# EAGLE design XBee_Explorer Thin (EAGLE 9.6.2)
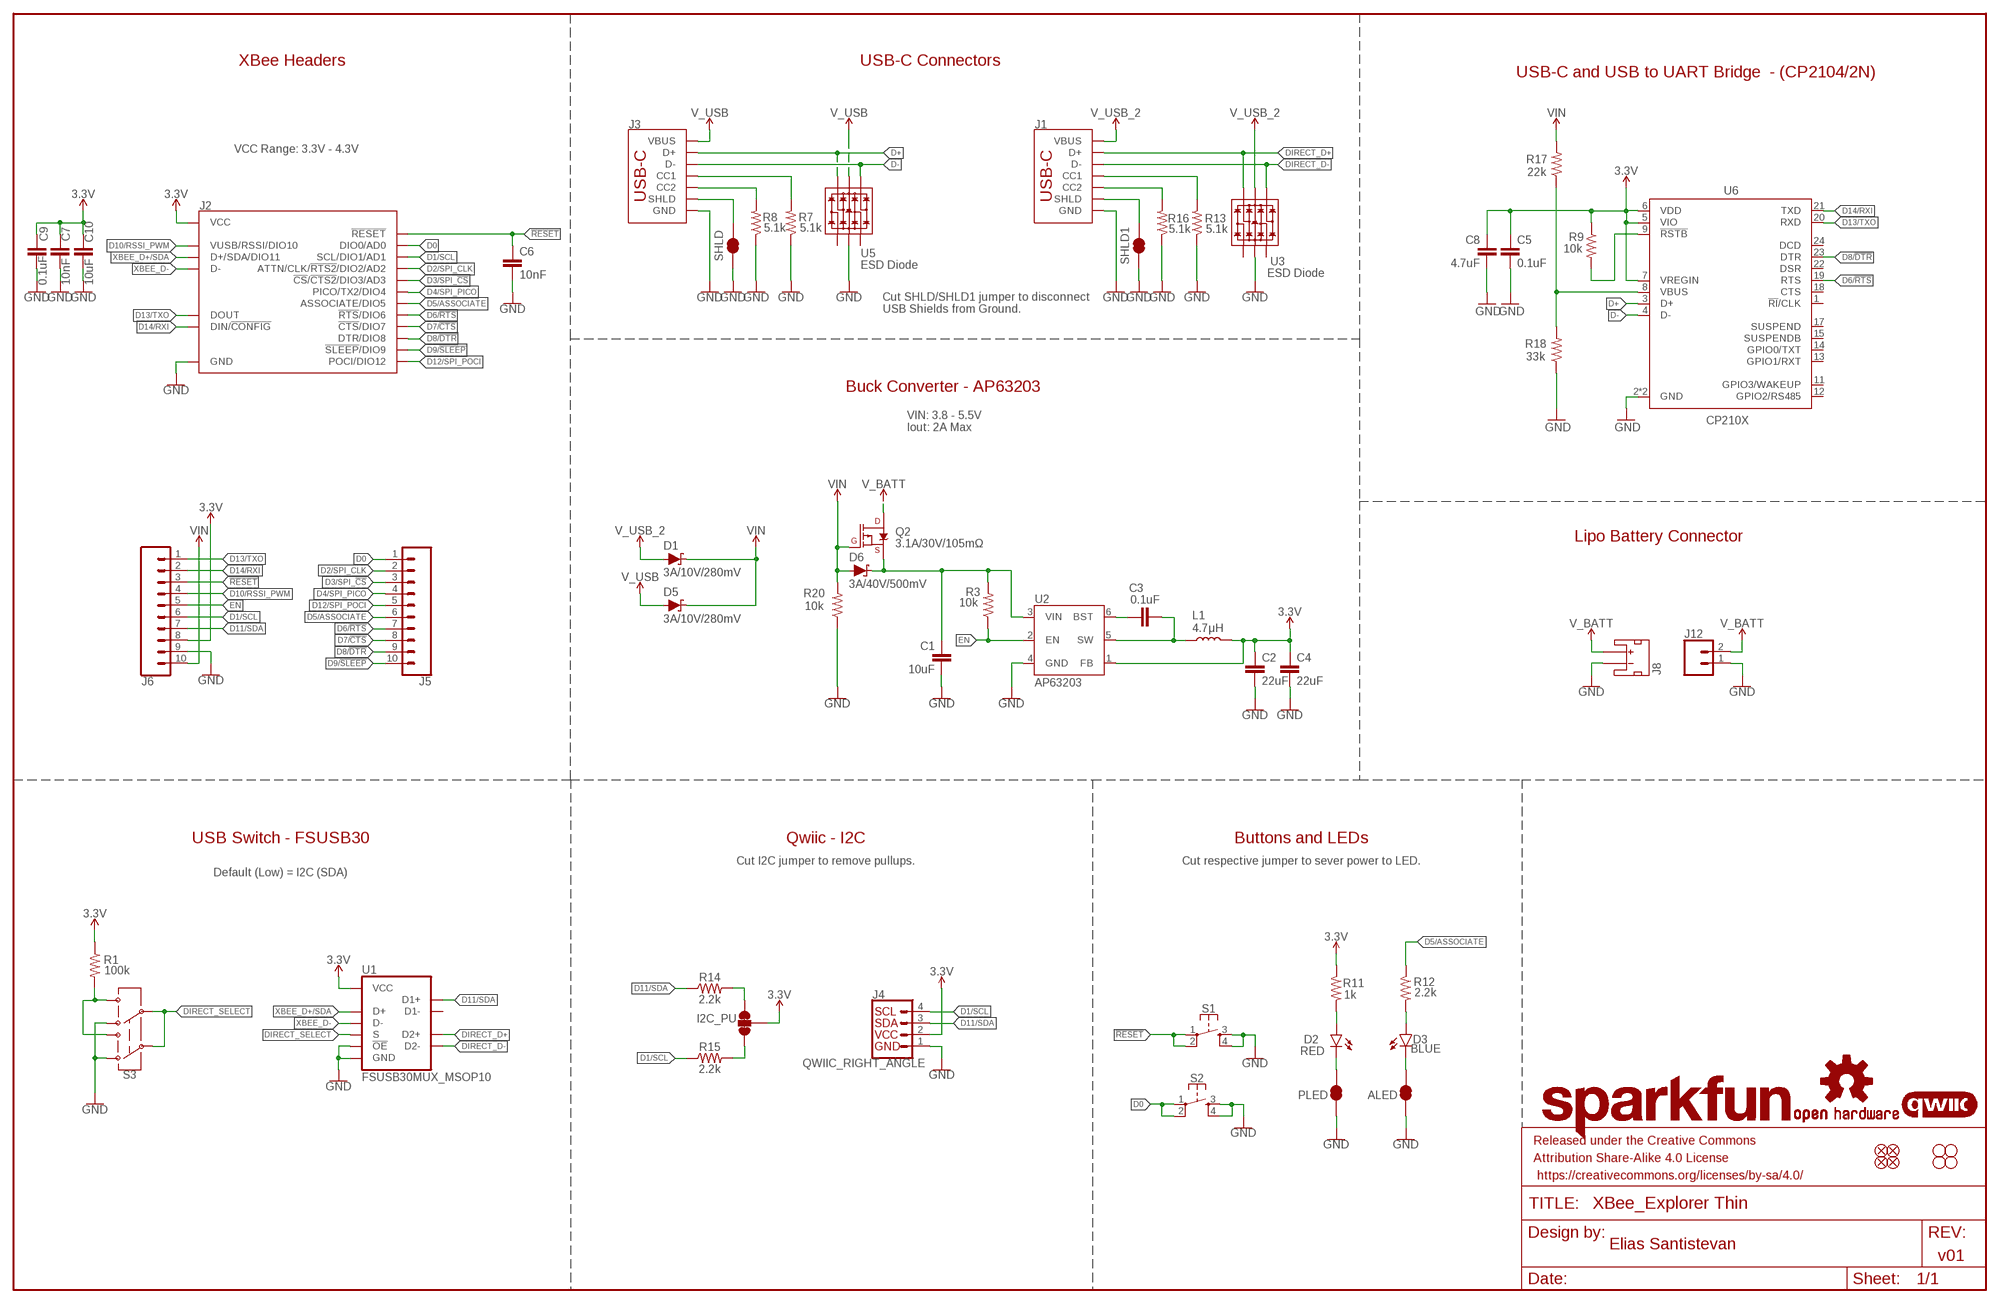
[diagram p0: schematic, sheet 1]

## Parts
ALED  JUMPER-SMT_2_NC_TRACE_SILK  [SMT-JUMPER_2_NC_TRACE_SILK]
C1  10uF  10UF-1210-50V-20%  [1210]
C2  22uF  22UF-0603-6.3V-20%  [0603]
C3  0.1uF  0.1UF-0603-25V-5%  [0603]
C4  22uF  22UF-0603-6.3V-20%  [0603]
C5  0.1uF  0.1UF-0603-25V-(+80/-20%)  [0603]
C6  10nF  10NF-0603-50V-10%  [0603]
C7  10nF  10NF-0603-50V-10%  [0603]
C8  4.7uF  4.7UF-0603-6.3V-(10%)  [0603]
C9  0.1uF  0.1UF-0603-25V-(+80/-20%)  [0603]
C10  10uF  10UF-0603-6.3V-20%  [0603]
D1  3A/10V/280mV  DIODE-SCHOTTKY-BAT60A  [SOD-323]
D2  RED  LED-RED0603  [LED-0603]
D3  BLUE  LED-BLUE0603  [LED-0603]
D5  3A/10V/280mV  DIODE-SCHOTTKY-BAT60A  [SOD-323]
D6  3A/40V/500mV  DIODE-SCHOTTKY-B340A  [SMA-DIODE]
FD1  FIDUCIAL1X2  [FIDUCIAL-1X2]
FD2  FIDUCIAL1X2  [FIDUCIAL-1X2]
FD3  FIDUCIAL1X2  [FIDUCIAL-1X2]
FD4  FIDUCIAL1X2  [FIDUCIAL-1X2]
FRAME1  FRAME-LEDGER  [CREATIVE_COMMONS]
H1  STAND-OFFTIGHT  [STAND-OFF-TIGHT]
H2  STAND-OFFTIGHT  [STAND-OFF-TIGHT]
H3  STAND-OFFTIGHT  [STAND-OFF-TIGHT]
H4  STAND-OFFTIGHT  [STAND-OFF-TIGHT]
I2C_PU  JUMPER-SMT_3_2-NC_TRACE_SILK  [SMT-JUMPER_3_2-NC_TRACE_SILK]
J1  USB_C_2-LAYER_PADS  [USB-C-16P-2LAYER-PADS]
J2  XBEE_UPDATEXBEE_SMD  [XBEE-SMD_SILK]
J3  USB_C_2-LAYER_PADS  [USB-C-16P-2LAYER-PADS]
J4  QWIIC_RIGHT_ANGLE  QWIIC_CONNECTORJS-1MM  [JST04_1MM_RA]
J5  CONN_10NO_SILK_PTH_FEMALE  [1X10_NO_SILK]
J6  CONN_10NO_SILK_PTH_FEMALE  [1X10_NO_SILK]
J8  JST_2MM_MALE  [JST-2-SMD]
J12  CONN_021X02_NO_SILK  [1X02_NO_SILK]
L1  4.7μH  4.7μH_SHIELDED_INDUCTORNPIS_LS  [INDUCTOR_4X4MM]
LOGO1  SFE_LOGO_NAME.1_INCH  [SFE_LOGO_NAME_.1]
LOGO2  OSHW-LOGOS  [OSHW-LOGO-S]
LOGO3  QWIIC_LOGO_5MM  [QWIIC_5MM]
PLED  JUMPER-SMT_2_NC_TRACE_SILK  [SMT-JUMPER_2_NC_TRACE_SILK]
Q2  3.1A/30V/105mΩ  MOSFET_PCH-DMG2307L  [SOT23-3]
R1  100k  100KOHM-0603-1/10W-1%  [0603]
R3  10k  10KOHM-0603-1/10W-1%  [0603]
R7  5.1k  5.1KOHM5.1KOHM-0603-1/10W-1%  [0603]
R8  5.1k  5.1KOHM5.1KOHM-0603-1/10W-1%  [0603]
R9  10k  10KOHM-0603-1/10W-1%  [0603]
R11  1k  1KOHM-0603-1/10W-1%  [0603]
R12  2.2k  2.2KOHM-0603-1/10W-1%  [0603]
R13  5.1k  5.1KOHM5.1KOHM-0603-1/10W-1%  [0603]
R14  2.2k  2.2KOHM-0603-1/10W-1%  [0603]
R15  2.2k  2.2KOHM-0603-1/10W-1%  [0603]
R16  5.1k  5.1KOHM5.1KOHM-0603-1/10W-1%  [0603]
R17  22k  22KOHM-0603-1/10W-1%  [0603]
R18  33k  33KOHM-0603-1/10W-1%  [0603]
R20  10k  10KOHM-0603-1/10W-1%  [0603]
S1  MOMENTARY-SWITCH-SPST-2-SMD-5.2MM-TALL  [TACTILE_SWITCH_SMD_5.2MM]
S2  MOMENTARY-SWITCH-SPST-2-SMD-5.2MM-TALL  [TACTILE_SWITCH_SMD_5.2MM]
S3  SWITCH-DPDT-SMD-AYZ0202  [SWITCH_DPDT_SMD_AYZ0202]
SHLD  JUMPER-SMT_2_NC_TRACE_SILK  [SMT-JUMPER_2_NC_TRACE_SILK]
SHLD1  JUMPER-SMT_2_NC_TRACE_SILK  [SMT-JUMPER_2_NC_TRACE_SILK]
U1  FSUSB30MUX_MSOP10  [MSOP10]
U2  AP63203  [SOT23-6]
U3  ESD Diode  TVS_DIODE_ARRAY_DT1042-04SO-7  [SOT-23-6]
U5  ESD Diode  TVS_DIODE_ARRAY_DT1042-04SO-7  [SOT-23-6]
U6  CP210X  CP2102N  [QFN24]

## Nets
3.3V: C2.1 C4.1 C5.1 C7.1 C8.1 C9.1 C10.1 I2C_PU.2 J2.1(VCC) J4.2 J6.8 L1.P$2 R1.1 R9.1 R11.1 U1.10(VCC) U2.1(FB) U6.5(VIO) U6.6(VDD) U6.7(VREGIN)
!RESET!: C6.1 J2.5(!RESET!) J6.3 S1.1 S1.2
D0: J2.20(DIO0/AD0) J5.1 S2.1 S2.2
D1/SCL: J2.19(SCL/DIO1/AD1) J4.4 J6.6 R15.1
D2/SPI_CLK: J2.18(ATTN/CLK/!RTS2!/DIO2/AD2) J5.2
D3/SPI_!CS!: J2.17(!CS!/!CTS2!/DIO3/AD3) J5.3
D4/SPI_PICO: J2.11(PICO/TX2/DIO4) J5.4
D5/ASSOCIATE: J2.15(ASSOCIATE/DIO5) J5.6 R12.1
D6/!RTS!: J2.16(!RTS!/DIO6) J5.7 U6.19(RTS)
D7/!CTS!: J2.12(!CTS!/DIO7) J5.8
D8/!DTR!: J2.9(DTR/DIO8) J5.9 U6.23(DTR)
D9/!SLEEP!: J2.13(!SLEEP!/DIO9) J5.10
D10/RSSI_PWM: J2.6(VUSB/RSSI/DIO10) J6.4
D11/SDA: J4.3 J6.7 R14.1 U1.2(D1+)
D12/SPI_POCI: J2.4(POCI/DIO12) J5.5
D13/TXO: J2.2(DOUT) J6.1 U6.20(RXD)
D14/RXI: J2.3(DIN/!CONFIG!) J6.2 U6.21(TXD)
D+ [Diff pairs]: J3.A6(D+) J3.B6(D+) U5.6(IO4) U6.3(D+)
D- [Diff pairs]: J3.A7(D-) J3.B7(D-) U5.4(IO3) U6.4(D-)
DIRECT_D+ [Diff pairs]: J1.A6(D+) J1.B6(D+) U1.3(D2+) U3.6(IO4)
DIRECT_D- [Diff pairs]: J1.A7(D-) J1.B7(D-) U1.7(D2-) U3.4(IO3)
DIRECT_SELECT: S3.2 S3.5 U1.1(S)
EN: J6.5 R3.1 U2.2(EN)
GND: ALED.1 C1.2 C2.2 C4.2 C5.2 C6.2 C7.2 C8.2 C9.2 C10.2 J1.GND J1.GND2(GND) J2.10(GND) J3.GND J3.GND2(GND) J4.1 J6.9 J8.1(-) J12.1 PLED.1 R7.1 R8.1 R13.1 R16.1 R18.1 R20.1 S1.3 S1.4 S2.3 S2.4 S3.3 S3.6 SHLD1.1 SHLD.1 U1.5(GND) U1.9(!OE!) U2.4(GND) U3.2(VSS) U5.2(VSS) U6.2(GND) U6.PAD(GND)
N$1: C3.1 U2.6(BST)
N$3: R1.2 S3.1 S3.4
N$4: J3.B5(CC2) R8.2
N$5: J3.A5(CC1) R7.2
N$7: D2.A R11.2
N$8: C3.2 L1.P$1 U2.5(SW)
N$9: R9.2 U6.9(!RSTB)
N$10: R17.1 R18.2 U6.8(VBUS)
N$11: I2C_PU.3 R14.2
N$12: D3.A R12.2
N$13: I2C_PU.1 R15.2
N$14: J1.B5(CC2) R16.2
N$15: C1.1 D6.C Q2.2(S) R3.2 U2.3(VIN)
N$16: J1.A5(CC1) R13.2
N$21: ALED.2 D3.C
N$23: D2.C PLED.2
SHLD: J3.SHLD1(SHLD) J3.SHLD2(SHLD) J3.SHLD3(SHLD) J3.SHLD4(SHLD) SHLD.2
SHLD1: J1.SHLD1(SHLD) J1.SHLD2(SHLD) J1.SHLD3(SHLD) J1.SHLD4(SHLD) SHLD1.2
V_BATT [POWER]: J8.2(+) J12.2 Q2.3(D)
V_USB: D5.A J3.VBUS1(VBUS) J3.VBUS2(VBUS) U5.5(VCC)
V_USB_2: D1.A J1.VBUS1(VBUS) J1.VBUS2(VBUS) U3.5(VCC)
VIN: D1.C D5.C D6.A J6.10 Q2.1(G) R17.2 R20.2
XBEE_D+/SDA [Diff pairs]: J2.7(D+/SDA/DIO11) U1.4(D+)
XBEE_D- [Diff pairs]: J2.8(D-) U1.6(D-)
Unconnected: J8.NC1(PAD1) J8.NC2(PAD2) U1.8(D1-) U3.1(IO1) U3.3(IO2) U5.1(IO1) U5.3(IO2) U6.1(!RI!/CLK) U6.11(GPIO3/WAKEUP) U6.12(GPIO2/RS485) U6.13(GPIO1/RXT) U6.14(GPIO0/TXT) U6.15(SUSPENDB) U6.17(SUSPEND) U6.18(CTS) U6.22(DSR) U6.24(DCD)

## Notes on the sheet
- XBee Headers | USB-C Connectors
- USB-C and USB to UART Bridge  - (CP2104/2N)
- VCC Range: 3.3V - 4.3V
- Cut SHLD/SHLD1 jumper to disconnect
  USB Shields from Ground.
- Buck Converter - AP63203
- VIN: 3.8 - 5.5V
  Iout: 2A Max
- Lipo Battery Connector
- USB Switch - FSUSB30 | Qwiic - I2C | Buttons and LEDs
- Cut I2C jumper to remove pullups. | Cut respective jumper to sever power to LED.
- Default (Low) = I2C (SDA)
- Elias Santistevan
- v01

## Library data of the parts
ALED PLED SHLD SHLD1 = SparkFun-Jumpers:JUMPER-SMT_2_NC_TRACE: Normally closed trace jumper This jumper has a trace between two pads so it's normally closed (NC). Use a razor knife to open the connection. For best results follow the IPC guidelines for cutting traces: Cutout at least 0.063 mm (0.005 in). Remove all loose material to clean up the cut area. Seal the cut with an approved epoxy. Reapply solder to reclose the connection.
C1 = SparkFun-Capacitors:10UF: 10.0µF ceramic capacitors A capacitor is a passive two-terminal electrical component used to store electrical energy temporarily in an electric field.; PROD_ID: CAP-09824
C2 C4 = SparkFun-Capacitors:22UF: 22µF ceramic capacitors A capacitor is a passive two-terminal electrical component used to store electrical energy temporarily in an electric field.; PROD_ID: CAP-14464
C3 = SparkFun-Capacitors:0.1UF: 0.1µF ceramic capacitors A capacitor is a passive two-terminal electrical component used to store electrical energy temporarily in an electric field.; PROD_ID: CAP-08604
C5 C9 = SparkFun-Capacitors:0.1UF: 0.1µF ceramic capacitors A capacitor is a passive two-terminal electrical component used to store electrical energy temporarily in an electric field.; PROD_ID: CAP-00810
C6 C7 = SparkFun-Capacitors:10NF: 0.01uF/10nF/10,000pF ceramic capacitors A capacitor is a passive two-terminal electrical component used to store electrical energy temporarily in an electric field. CAP-09321; PROD_ID: CAP-00867
C8 = SparkFun-Capacitors:4.7UF: 4.7µF ceramic capacitors A capacitor is a passive two-terminal electrical component used to store electrical energy temporarily in an electric field.; PROD_ID: CAP-08280
C10 = SparkFun-Capacitors:10UF: 10.0µF ceramic capacitors A capacitor is a passive two-terminal electrical component used to store electrical energy temporarily in an electric field.; PROD_ID: CAP-11015
D1 D5 = SparkFun-DiscreteSemi:DIODE-SCHOTTKY: Schottky diode A Schottky diode is a semiconductor diode which has a low forward voltage drop and a very fast switching action.; PROD_ID: DIO-14072
D2 = SparkFun-LED:LED-RED: Red SMD LED Used in manufacturing of most products at SparkFun Packages: 0603 - SMD 0603 package [Product Link] <http://docs.avagotech.com/docs/AV02-0551EN> 0603 SMART - SMD 0603 SMART package ( more efficient and expensive)[Product Link] <http://www.osram-os.com/Graphics/XPic2/00077099_0.pdf> 1206 - SMD1206 package [Product Link] <https://www.sparkfun.com/datasheets/DevTools/LilyPad/Q150OVS4.pdff> SparkFun Products: Pro Mini 328 -5V <https://www.sparkfun.com/products/821> RedBoard <https://www.sparkfun.com/products/12757> IOIO-OTG <https://www.sparkfun.com/products/13613>; PROD_ID: DIO-00819
D3 = SparkFun-LED:LED-BLUE: Blue SMD LED Used in manufacturing of various products at SparkFun Packages: 0603 - SMD 0603 package [Product Link] <http://www.digikey.com/product-detail/en/SMLE12BC7TT86/511-1589-2-ND/1641808> 1206 - SMD1206 package [Product Link] <http://www.digikey.com/product-detail/en/lite-on-inc/LTST-C150TBKT/160-1643-1-ND/573584> SparkFun Products: ESP8266 Thing-Dev Board <https://www.sparkfun.com/products/13711> RedBoard <https://www.sparkfun.com/products/12757>; PROD_ID: DIO-08575
D6 = SparkFun-DiscreteSemi:DIODE-SCHOTTKY: Schottky diode A Schottky diode is a semiconductor diode which has a low forward voltage drop and a very fast switching action.; PROD_ID: DIO-09886
FD1-FD4 = SparkFun-Aesthetics:FIDUCIAL: Fiducial Alignment Points Point-of-reference for pick-and-place machines and other optical instruments.
FRAME1 = SparkFun-Aesthetics:FRAME-LEDGER: Schematic Frame - Ledger Standard 11x14 US Ledger frame
H1-H4 = SparkFun-Hardware:STAND-OFF: Stand Off Drill holes for mechanically mounting via screws, standoffs, etc. Note: Use the keepout ring to avoid running the screw head into surrounding components. Variant Overviews STAND-OFF - Mechanical footprint for a #4 phillips button head screw. STAND-OFF-TIGHT - Mechanical footprint for a #4 phillips button head screw, Example SparkFun Products Screw - Phillips Head (1/4", 4-40, 10 pack) <https://www.sparkfun.com/products/10453> (PRT-10453) Screw - Phillips Head (1/2", 4-40, 10 pack) <https://www.sparkfun.com/products/10452> (PRT-10452) Screw - Phillips Head (3/4", 4-40, 10 pack) <https://www.sparkfun.com/products/10451> (PRT-10451) Screw - Phillips Head (1", 4-40, 10 pack) <https://www.sparkfun.com/products/10450> (PRT-10450)
I2C_PU = SparkFun-Jumpers:JUMPER-SMT_3_2-NC_TRACE: Normally closed trace jumper (2 of 2 connections) This jumper has a trace between all three pads so they are normally closed (NC). Use a razor knife to open the connection(s). For best results follow the IPC guidelines for cutting traces: Cutout at least 0.063 mm (0.005 in). Remove all loose material to clean up the cut area. Seal the cut with an approved epoxy. Reapply solder to reclose the connection(s).
J1 J3 = SparkFun-Connectors:USB_C: USB Type C 16Pin Connector Super Speed pins not available on the 16-pin purely SMD connector so this part is best for USB 2.0 implementations. D1 and D2 are tied together enabling D+/- no matter which way the cable is plugged into the connector. The two channel configuration pins (CC1/2) are exposed. These are normally connected to ground via 5.1k resistors but can be reconfigured for high current/high power applications. **4-LAYER BOARD WARNING!!** If designing 4-layer board, make sure to select the variant _4-LAYER-ISOLATED. The linked footprint (USB-C-16-4LAYER-ISOLATED) includes some very necessary cutout polygons in the inner layers (2 and 15). This prevents the PTH mounting shield legs on the USB connector from electrically connecting any other polygons on the inner layers (usually VCC and GND).; PROD_ID: CONN-14122
J2 = xbee_improved:XBEE_UPDATE: Digi XBee and XBee Pro XBees are tiny blue chips that can communicate wirelessly with each other. They can do simple things, like replacing a couple of wires in serial communication, which is nice when you want to make a remote for your paintball vehicle. SparkFun Products SparkFun XBee Buying Guide <https://www.sparkfun.com/pages/xbee_guide> SparkFun XBee Explorer USB <https://www.sparkfun.com/products/11812> (WRL-11812) Breakout Board for XBee Module <https://www.sparkfun.com/products/8276> (WRL-8276) SparkFun XBee Explorer Regulated <https://www.sparkfun.com/products/11373> (WRL-11373) SparkFun XBee Explorer Dongle <https://www.sparkfun.com/products/11697> (WRL-11697) SparkFun XBee Shield <https://www.sparkfun.com/products/12847> (WRL-12847) SparkFun XBee Explorer Serial <https://www.sparkfun.com/products/13225> (WRL-13225)
J4 = SparkFun-Connectors:QWIIC_CONNECTOR: SparkFun I2C Standard Qwiic Connector An SMD 1mm pitch JST connector makes it easy and quick (get it? Qwiic?) to connect I2C devices to each other. The Qwiic system <http://www.sparkfun.com/qwiic> enables fast and solderless connection between popular platforms and various sensors and actuators. We carry 200mm <https://www.sparkfun.com/products/14204>, 100mm <https://www.sparkfun.com/products/14205>, 50mm <https://www.sparkfun.com/products/14206>, and breadboard friendly <https://www.sparkfun.com/products/14207> Qwiic cables. We also offer 10 pcs strips <https://www.sparkfun.com/products/14323> the SMD connectors.; PROD_ID: CONN-13694
J5 J6 = SparkFun-Connectors:CONN_10: Multi connection point. Often used as Generic Header-pin footprint for 0.1 inch spaced/style header connections On any of the 0.1 inch spaced packages, you can populate with these: Break Away Headers - Straight <https://www.sparkfun.com/products/116> (PRT-00116) Break Away Male Headers - Right Angle <https://www.sparkfun.com/products/553> (PRT-00553) Female Headers <https://www.sparkfun.com/products/115> (PRT-00115) Break Away Headers - Machine Pin <https://www.sparkfun.com/products/117> (PRT-00117) Break Away Female Headers - Swiss Machine Pin <https://www.sparkfun.com/products/743> (PRT-00743) Arduino Stackable Header - 10 Pin <https://www.sparkfun.com/products/11376> (PRT-11376) For SCREWTERMINALS and SPRING TERMINALS visit here: Screw Terimnals on SparkFun.com <https://www.sparkfun.com/search/results?term=Screw+Terminals> (5mm/3.5mm/2.54mm spacing) This device is also useful as a general connection point to wire up your design to another part of your project. Our various solder wires solder well into these plated through hole pads. Hook-Up Wire - Assortment (Stranded, 22 AWG) <https://www.sparkfun.com/products/11375> (PRT-11375) Hook-Up Wire - Assortment (Solid Core, 22 AWG) <https://www.sparkfun.com/products/11367> (PRT-11367) View the entire wire category on our website here <https://www.sparkfun.com/categories/141> Special notes: Molex polarized connector foot print use with SKU : PRT-08231 with associated crimp pins and housings. 1MM SMD Version SKU: PRT-10208 NOTES ON THE VARIANTS LOCK and LOCK_LONGPADS... This footprint was designed to help hold the alignment of a through-hole component (i.e. 6-pin header) while soldering it into place. You may notice that each hole has been shifted either up or down by 0.005 of an inch from it's more standard position (which is a perfectly straight line). This slight alteration caused the pins (the squares in the middle) to touch the edges of the holes. Because they are alternating, it causes a "brace" to hold the component in place. 0.005 has proven to be the perfect amount of "off-center" position when using our standard breakaway headers. Although looks a little odd when you look at the bare footprint, once you have a header in there, the alteration is very hard to notice. Also,if you push a header all the way into place, it is covered up entirely on the bottom side.
J8 = SparkFun-Connectors:JST_2MM_MALE: JST 2MM MALE RA CONNECTOR Two pin, compact surface mount connector. Commonly used as a battery input connection point. We really like the solid locking feeling and high current rating on these small connectors. We use these all the time as battery connectors. Mates to single-cell LiPo batteries. Here is the connector we sell at SparkFun: JST Right Angle Connector - White <https://www.sparkfun.com/products/8612> (PRT-08612) Datasheet <http://www.sparkfun.com/datasheets/Prototyping/Connectors/JST-Horizontal.pdf> It was used on these SparkFun products: SparkFun MOSFET Power Controller <https://www.sparkfun.com/products/11214> (PRT-11214) SparkFun Battery Babysitter - LiPo Battery Manager <https://www.sparkfun.com/products/13777> (PRT-13777) And many, many others that required a lipo battery connection.; PROD_ID: CONN-11443; SF_ID: PRT-08612
J12 = SparkFun-Connectors:CONN_02: Multi connection point. Often used as Generic Header-pin footprint for 0.1 inch spaced/style header connections On any of the 0.1 inch spaced packages, you can populate with these: Break Away Headers - Straight <https://www.sparkfun.com/products/116> (PRT-00116) Break Away Male Headers - Right Angle <https://www.sparkfun.com/products/553> (PRT-00553) Female Headers <https://www.sparkfun.com/products/115> (PRT-00115) Break Away Headers - Machine Pin <https://www.sparkfun.com/products/117> (PRT-00117) Break Away Female Headers - Swiss Machine Pin <https://www.sparkfun.com/products/743> (PRT-00743) For SCREWTERMINALS and SPRING TERMINALS visit here: Screw Terimnals on SparkFun.com <https://www.sparkfun.com/search/results?term=Screw+Terminals> (5mm/3.5mm/2.54mm spacing) This device is also useful as a general connection point to wire up your design to another part of your project. Our various solder wires solder well into these plated through hole pads. Hook-Up Wire - Assortment (Stranded, 22 AWG) <https://www.sparkfun.com/products/11375> (PRT-11375) Hook-Up Wire - Assortment (Solid Core, 22 AWG) <https://www.sparkfun.com/products/11367> (PRT-11367) View the entire wire category on our website here <https://www.sparkfun.com/categories/141> Special notes: Molex polarized connector foot print use with: PRT-08233 with associated crimp pins and housings. 2.54_SCREWTERM for use with PRT-10571. 3.5mm Screw Terminal footprints for PRT-08084 5mm Screw Terminal footprints for use with PRT-08432
L1 = SparkFun-Coils:4.7μH_SHIELDED_INDUCTOR: 4.7uH Inductor 4.7uH 1.4A 50mOhm 1008(2520) Package Shielded; PROD_ID: NDUC-15245
LOGO1 = SparkFun-Aesthetics:SFE_LOGO_NAME: SparkFun Font Logo This is the SparkFun name logo. The logo on the schematic will always be the same size; the package variant is the height of the flame part of the logo (or the height the flame would be, if it were drawn). Default layer for the logo on the board is tSilk.
LOGO2 = SparkFun-Aesthetics:OSHW-LOGO: Open-Source Hardware (OSHW) Logo This logo indicates the piece of hardware it is found on incorporates a OSHW license and/or adheres to the definition of open source hardware found here: http://freedomdefined.org/OSHW
LOGO3 = SparkFun-Aesthetics:QWIIC_LOGO: Qwiic Logos for placement on schematic and PCB. The 5.5mm silk logo is best for placing next to Qwiic connector.
Q2 = SparkFun-DiscreteSemi:MOSFET_PCH: P-channel MOSFETs Voltage controlled devices that allow control of high current outputs. SparkFun Products: SparkFun ESP32 Thing <https://www.sparkfun.com/products/13907> SparkFun ESP8266 Thing <https://www.sparkfun.com/products/13231> SparkFun Pi Servo HAT V2 <https://www.sparkfun.com/products/15316> DMG2305UX-7 (20V/4.2A/SOT23-3); PROD_ID: TRANS-11308
R1 = SparkFun-Resistors:100KOHM: 100kΩ resistor A resistor is a passive two-terminal electrical component that implements electrical resistance as a circuit element. Resistors act to reduce current flow, and, at the same time, act to lower voltage levels within circuits. - Wikipedia; PROD_ID: RES-07828
R3 R9 R20 = SparkFun-Resistors:10KOHM: 10kΩ resistor A resistor is a passive two-terminal electrical component that implements electrical resistance as a circuit element. Resistors act to reduce current flow, and, at the same time, act to lower voltage levels within circuits. - Wikipedia; PROD_ID: RES-00824
R7 R8 R13 R16 = SparkFun-Resistors:5.1KOHM; PROD_ID: RES-12083
R11 = SparkFun-Resistors:1KOHM: 1kΩ resistor A resistor is a passive two-terminal electrical component that implements electrical resistance as a circuit element. Resistors act to reduce current flow, and, at the same time, act to lower voltage levels within circuits. - Wikipedia; PROD_ID: RES-07856
R12 R14 R15 = SparkFun-Resistors:2.2KOHM: 2.2kΩ resistor A resistor is a passive two-terminal electrical component that implements electrical resistance as a circuit element. Resistors act to reduce current flow, and, at the same time, act to lower voltage levels within circuits. - Wikipedia; PROD_ID: RES-08272
R17 = SparkFun-Resistors:22KOHM: 22kΩ resistor A resistor is a passive two-terminal electrical component that implements electrical resistance as a circuit element. Resistors act to reduce current flow, and, at the same time, act to lower voltage levels within circuits. - Wikipedia; PROD_ID: RES-07853
R18 = SparkFun-Resistors:33KOHM: 33kΩ resistor A resistor is a passive two-terminal electrical component that implements electrical resistance as a circuit element. Resistors act to reduce current flow, and, at the same time, act to lower voltage levels within circuits. - Wikipedia; PROD_ID: RES-08416
S1 S2 = SparkFun-Switches:MOMENTARY-SWITCH-SPST-2: Momentary Switch (Pushbutton) - SPST - Two Circuits Normally-open (NO) SPST momentary switches (buttons, pushbuttons). Schematic symbol includes two switch circuits. Variants SMD-4.6MMX2.8MM - 4.60mm x 2.80mm Tactile Momentary Button Switch - Used on SparkFun Pro Micro - RP2040 <https://www.sparkfun.com/products/17717> SMD-5.2MM - Mini Pushbutton Switch - SMD <https://www.sparkfun.com/products/8720> - Used on Arduino Pro Mini <https://www.sparkfun.com/products/11114>; PROD_ID: SWCH-14139
S3 = SparkFun-Switches:SWITCH-DPDT: Double-Pole, Double-Throw (DPDT) Switch Double-pole, double-throw switches. Variant Overview PTH-GPI-152-3013 Used on SparkFun Geiger Counter <https://www.sparkfun.com/products/11345> SMD-AY0202 Surface Mount DPDT Switch <https://www.sparkfun.com/products/597> (COM-00597) Used on e.g. LilyPad Arduino USB - ATmega32U4 Board <https://www.sparkfun.com/products/12049>; PROD_ID: SWCH-08179; SF_SKU: COM-00597
U1 = SparkFun-IC-Special-Function:FSUSB30MUX; PROD_ID: IC-15569
U2 = SparkFun-IC-Power:AP63203: Diodes Inc. AP63203 3.8V-32V input 3.3V Buck The AP63200/AP63201/AP63203/AP63205 is a 2A, synchronous buck converter with a wide input voltage range of 3.8V to 32V and fully integrates a 125mΩ high-side power MOSFET and a 68mΩ lowside power MOSFET to provide high-efficiency step-down DC/DC conversion; PROD_ID: VREG-15244
U3 U5 = SparkFun-DiscreteSemi:TVS_DIODE_ARRAY; PROD_ID: IC-13538
U6 = SparkFun-IC-Comms:CP2102N; PROD_ID: IC-14020

## Net classes
1 POWER: width 0.559 mm, drill 0.305 mm
2 Diff pairs: width 0.203 mm, drill 0.305 mm, clearance 0.152 mm

## Board
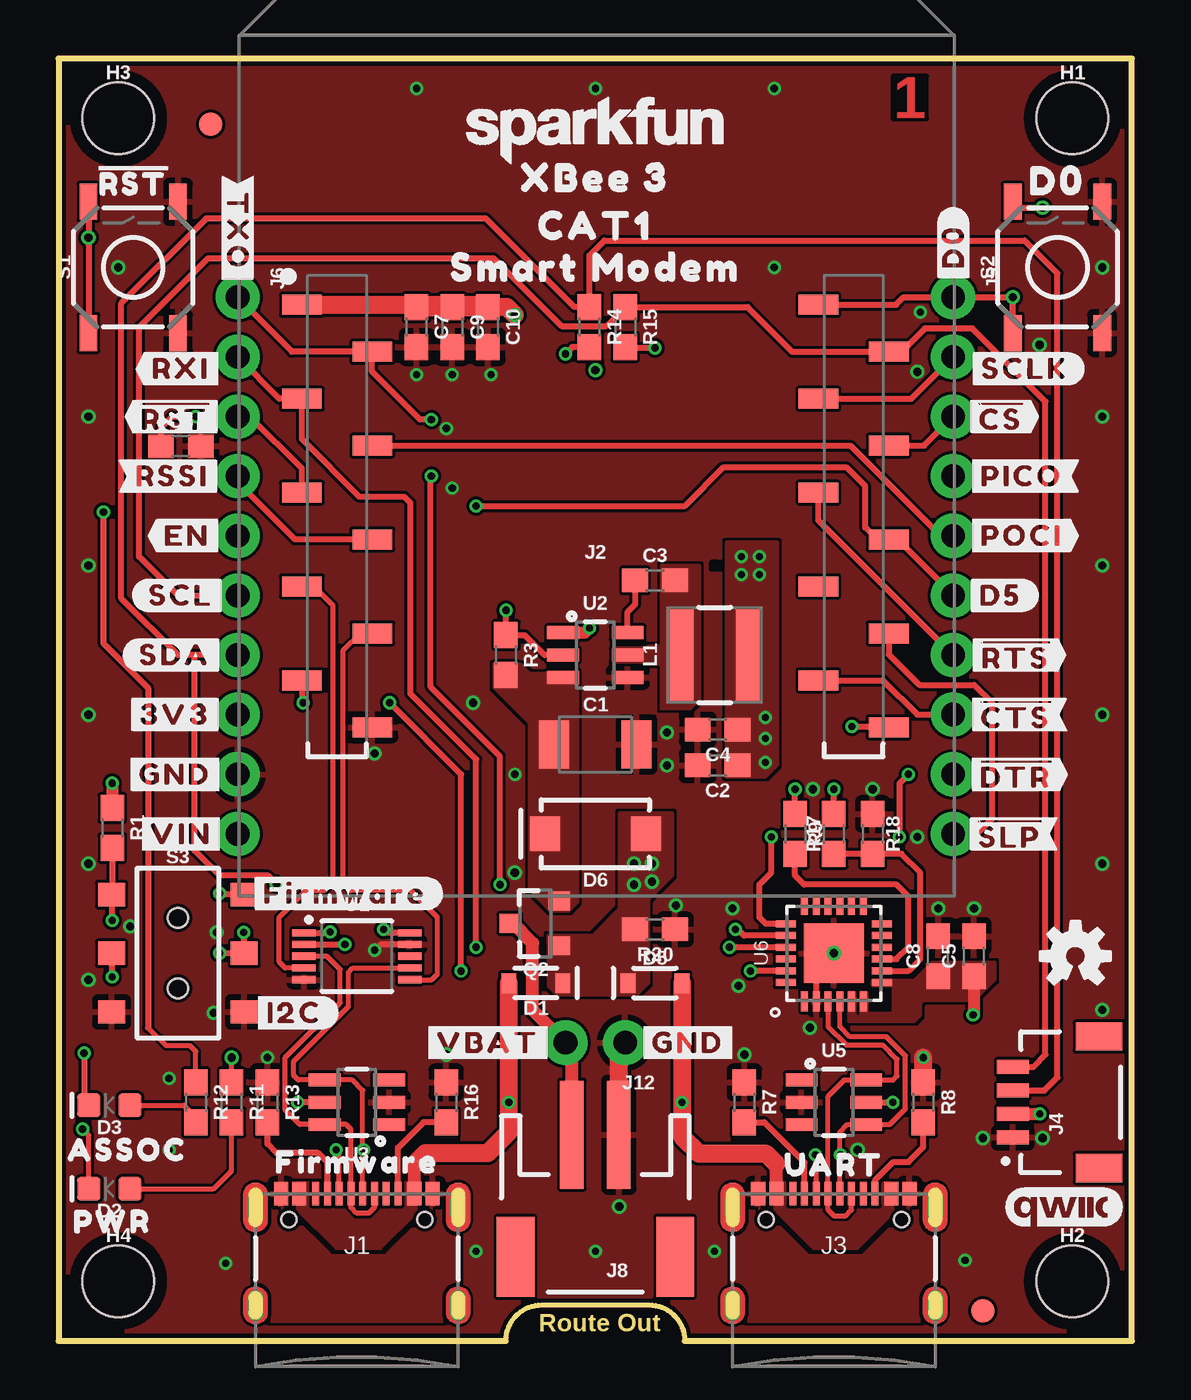
[diagram p1: board, top side]
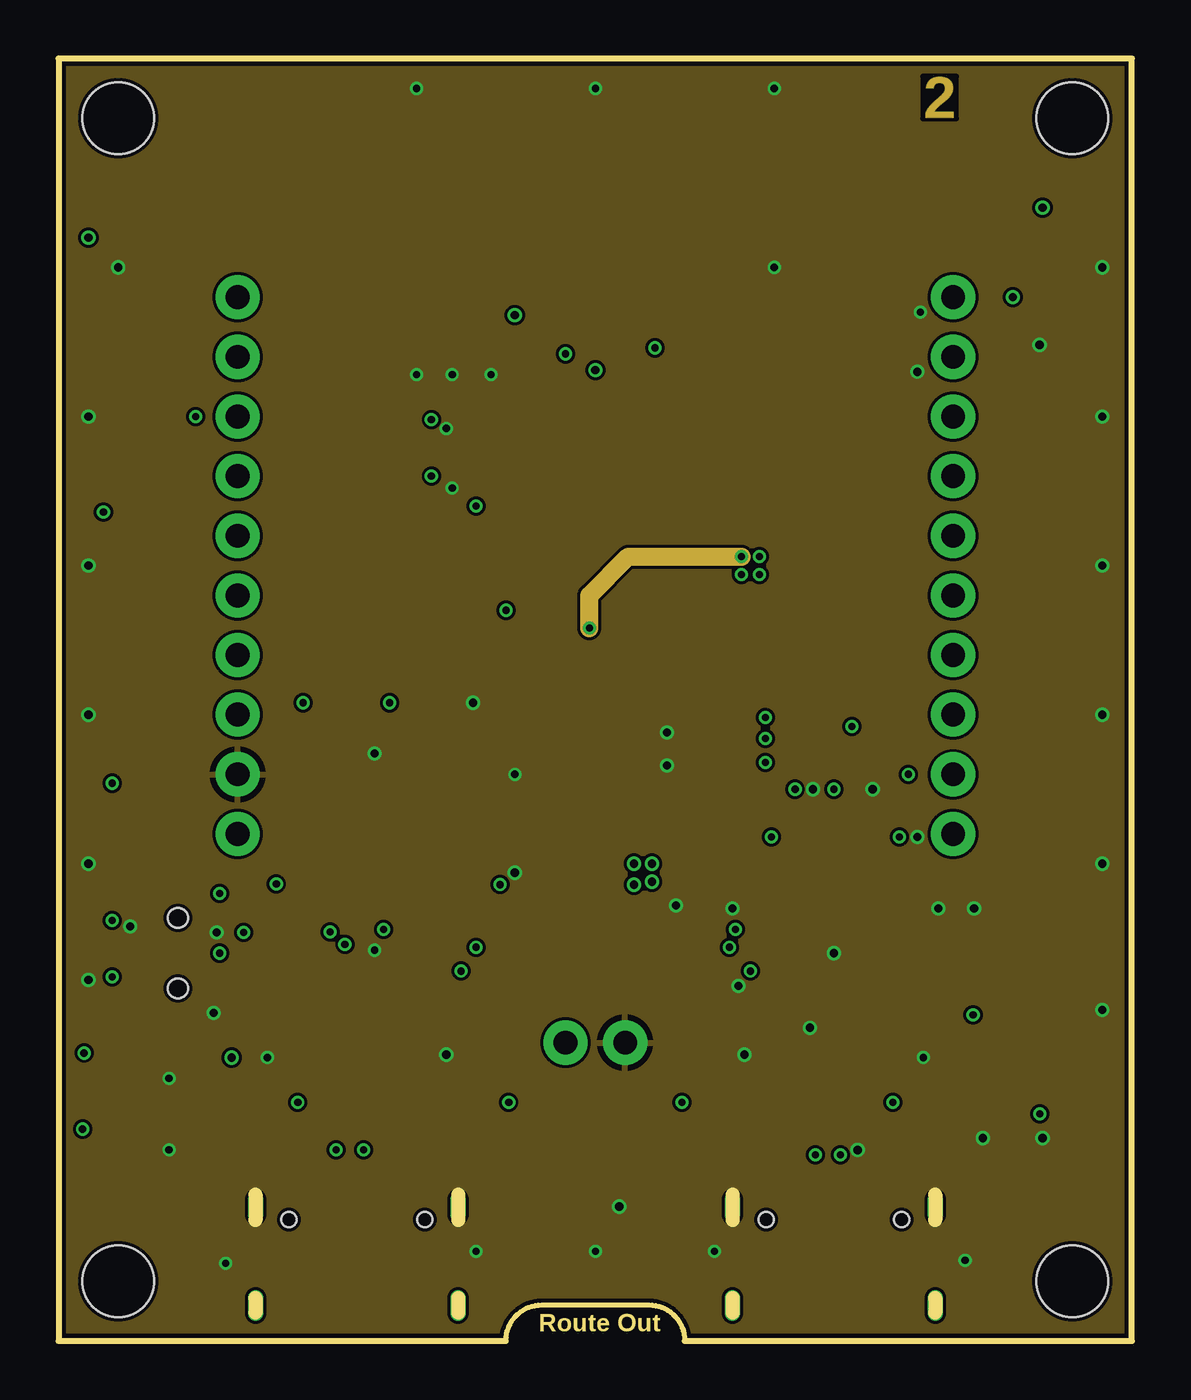
[diagram p2: board, inner layer Route2]
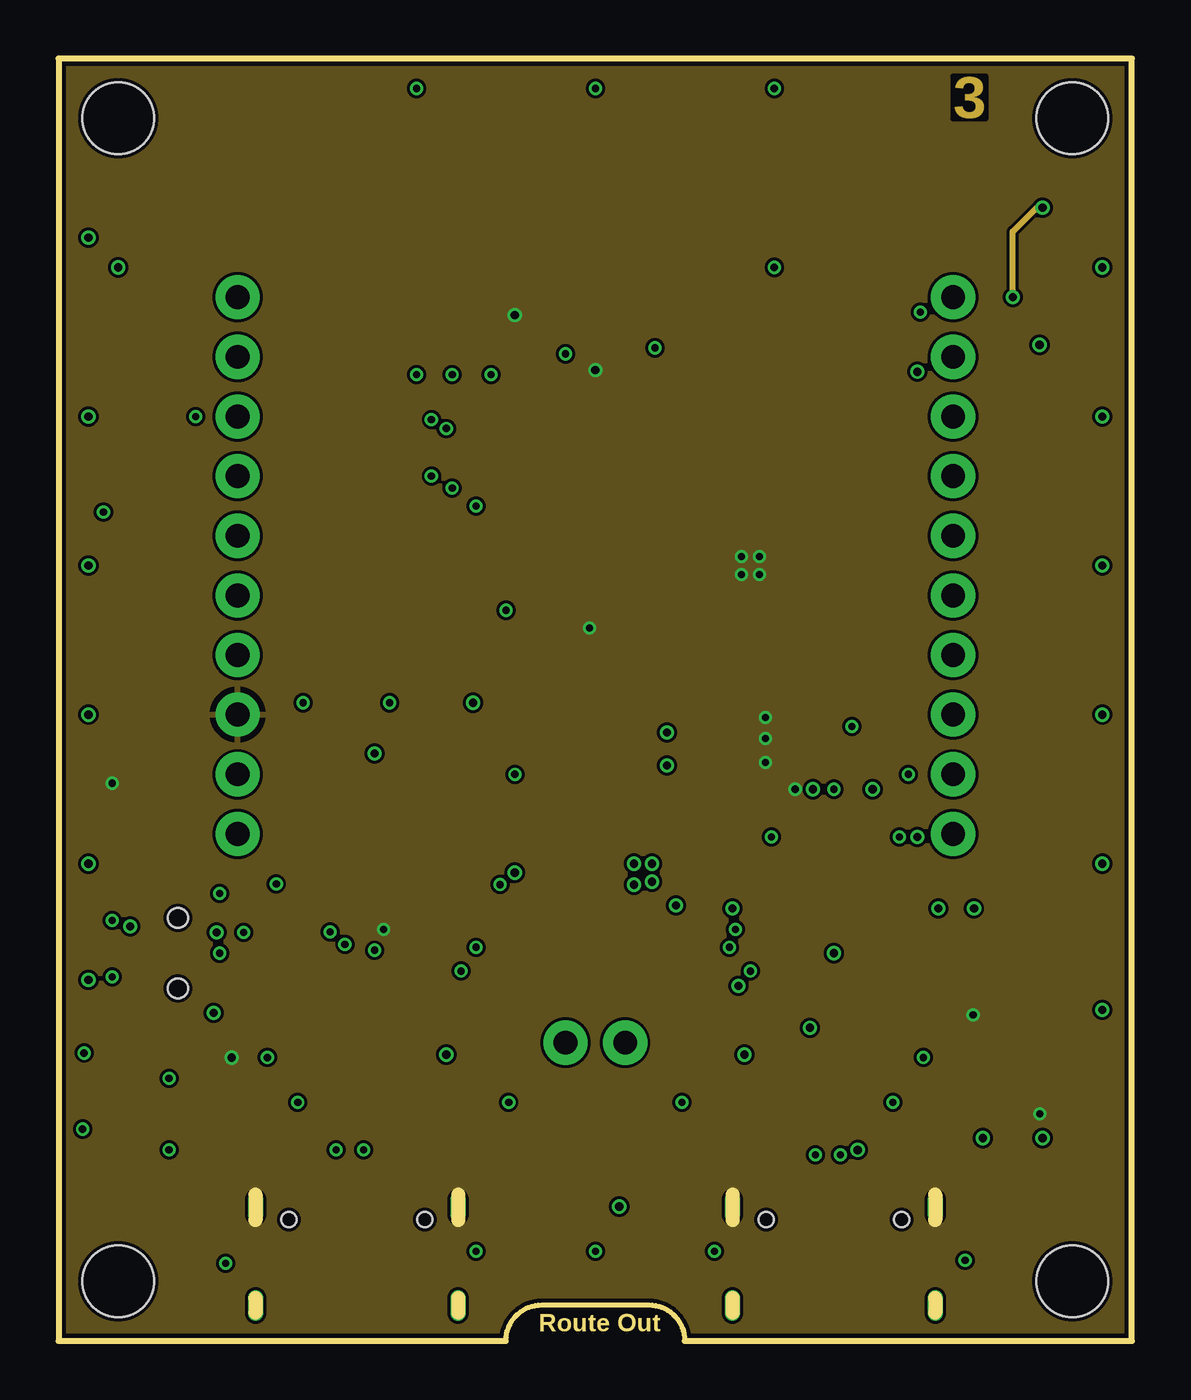
[diagram p3: board, inner layer Route15]
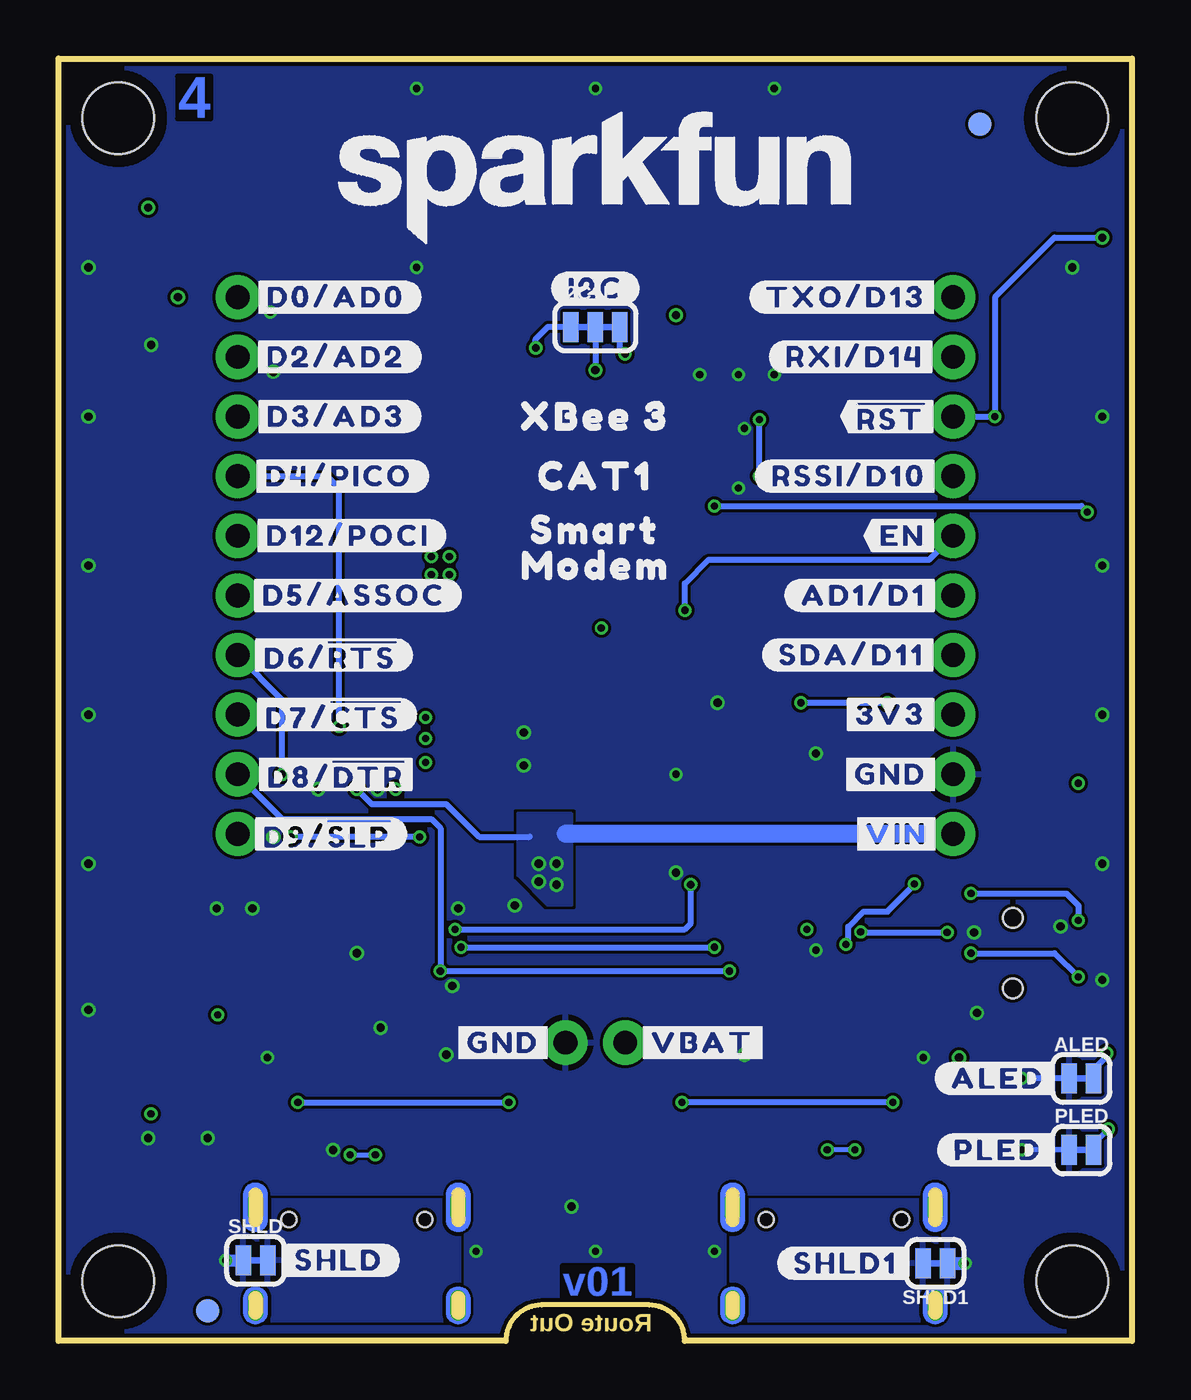
[diagram p4: board, bottom side, seen from below]

Size 45.72 x 54.61 mm. Coordinates in mm from the lower left corner, seen from the top.
Outline: 0,54.61 0,0 19.05,0 arc-90 20.57,1.52 25.15,1.52 arc-90 26.67,0 45.72,0 45.72,54.61 0,54.61
Copper layers (1*2*15*16): Top 0.035559375mm / dielectric 0.47751875mm / Route2 0.035559375mm / dielectric 0.47751875mm / Route15 0.035559375mm / dielectric 0.47751875mm / Bottom 0.035559375mm
Design rules "SparkFun-4-Layer-Minimum-JLCPCB": minimum track width 5mil, minimum drill 0.2mm, track to track 5mil, track to pad 5mil, pad to pad 5mil, via to via 5mil, smd to smd 5mil, copper to edge 7mil, drill to drill 7mil, minimum pad ring 5mil, minimum via ring 5mil, stop-mask expansion 2.5mil, vias tented up to drill 25mil, thermal gap 10mil
tRestrict: area 27.8,32.9 to 28.1,33.1

### Footprints (pad centres in the part's own frame; a part is rotated, then mirrored left to right if it is on the bottom)
SMT-JUMPER_2_NC_TRACE_SILK = smd 0.66 x 1.27: 1 -0.521,0; 2 0.521,0
1210 = smd 1.27 x 2.06: 1 -1.755,0; 2 1.755,0
0603 = smd 1.1 x 1: 1 -0.85,0; 2 0.85,0
SOD-323 = smd 0.63 x 0.83: A 1.15,0; C -1.15,0
LED-0603 = smd 1 x 1: A -0.877,0; C 0.877,0
SMA-DIODE = smd 1.27 x 1.47: A -2.15,0; C 2.15,0
FIDUCIAL-1X2 = smd 1 x 1: 1 0,0
STAND-OFF-TIGHT = hole 3.048: 0,0
SMT-JUMPER_3_2-NC_TRACE_SILK = smd 0.66 x 1.27: 1 -1.041,0; 2 0,0; 3 1.041,0
USB-C-16P-2LAYER-PADS = smd 0.3 x 1: A5 -1.25,-0.34; A6 -0.25,-0.34; A7 0.25,-0.34; A8 1.25,-0.34; B5 1.75,-0.34; B6 0.75,-0.34; B7 -0.75,-0.34; B8 -1.75,-0.34 | smd 0.6 x 1: GND -3.225,-0.34; GND2 3.225,-0.34; VBUS1 -2.45,-0.34; VBUS2 2.45,-0.34 | drill 0.4 pad 0.6 long: SHLD1 -4.318,-0.915; SHLD2 4.318,-0.915; SHLD3 -4.318,-5.095; SHLD4 4.318,-5.095 | hole 0.65: -2.89,-1.445; 2.89,-1.445
XBEE-SMD_SILK = smd 1.7 x 0.85: 1 -12.5,11.11; 2 -9.5,9.11; 3 -12.5,7.11; 4 -9.5,5.11; 5 -12.5,3.11; 6 -9.5,1.11; 7 -12.5,-0.89; 8 -9.5,-2.89; 9 -12.5,-4.89; 10 -9.5,-6.89; 11 12.5,-6.89; 12 9.5,-4.89; 13 12.5,-2.89; 14 9.5,-0.89; 15 12.5,1.11; 16 9.5,3.11; 17 12.5,5.11; 18 9.5,7.11; 19 12.5,9.11; 20 9.5,11.11
JST04_1MM_RA = smd 0.6 x 1.35: 1 -1.5,0; 2 -0.5,0; 3 0.5,0; 4 1.5,0 | smd 1.2 x 2: NC1 2.8,-3.675; NC2 -2.8,-3.675
1X10_NO_SILK = drill 1.016 pad 1.88: 1 0,0; 2 2.54,0; 3 5.08,0; 4 7.62,0; 5 10.16,0; 6 12.7,0; 7 15.24,0; 8 17.78,0; 9 20.32,0; 10 22.86,0
JST-2-SMD = smd 1 x 4.6: 1 -1,-3.7; 2 1,-3.7 | smd 1.6 x 3.4: NC1 -3.4,1.5; NC2 3.4,1.5
1X02_NO_SILK = drill 1.016 pad 1.88: 1 0,0; 2 2.54,0
INDUCTOR_4X4MM = smd 4.089 x 1.143: P$1 0,1.473; P$2 0,-1.473
SOT23-3 = smd 0.8 x 0.9: 1 -0.95,-1; 2 0.95,-1; 3 0,1.1
TACTILE_SWITCH_SMD_5.2MM = smd 1.524 x 0.762: 1 -2.794,1.905; 2 2.794,1.905; 3 -2.794,-1.905; 4 2.794,-1.905
SWITCH_DPDT_SMD_AYZ0202 = smd 1 x 1.15: 1 -2.5,2.825; 2 0,2.825; 3 2.5,2.825; 4 -2.5,-2.825; 5 0,-2.825; 6 2.5,-2.825 | hole 0.85: 1.5,0; -1.5,0
MSOP10 = smd 1 x 0.3: 1 -2.25,1; 2 -2.25,0.5; 3 -2.25,0; 4 -2.25,-0.5; 5 -2.25,-1; 6 2.25,-1; 7 2.25,-0.5; 8 2.25,0; 9 2.25,0.5; 10 2.25,1
SOT23-6 = smd 0.55 x 1.35: 1 -0.95,-1.375; 2 0,-1.375; 3 0.95,-1.375; 4 0.95,1.375; 5 0,1.375; 6 -0.95,1.375
SOT-23-6 = smd 0.55 x 1.35: 1 -0.95,-1.375; 2 0,-1.375; 3 0.95,-1.375; 4 0.95,1.375; 5 0,1.375; 6 -0.95,1.375
QFN24 = smd 0.85 x 0.3: 1 -2.05,1.25; 2 -2.05,0.75; 3 -2.05,0.25; 4 -2.05,-0.25; 5 -2.05,-0.75; 6 -2.05,-1.25; 13 2.05,-1.25; 14 2.05,-0.75; 15 2.05,-0.25; 16 2.05,0.25; 17 2.05,0.75; 18 2.05,1.25 | smd 0.3 x 0.85: 7 -1.25,-2.05; 8 -0.75,-2.05; 9 -0.25,-2.05; 10 0.25,-2.05; 11 0.75,-2.05; 12 1.25,-2.05; 19 1.25,2.05; 20 0.75,2.05; 21 0.25,2.05; 22 -0.25,2.05; 23 -0.75,2.05; 24 -1.25,2.05 | smd 2.55 x 2.55: PAD 0,0

### Placement (x,y rotation side)
ALED  2.16,11.18 0 bottom
C1  22.86,25.4 0 top
C2  28.07,24.51 180 top
C3  25.4,32.38 0 top
C4  28.07,26.04 180 top
C5  38.99,16.38 90 top
C6  5.21,38.1 0 top
C7  15.24,43.18 270 top
C8  37.47,16.38 90 top
C9  16.76,43.18 270 top
C10  18.29,43.18 270 top
D1  20.32,15.24 180 top
D2  2.16,6.48 180 top
D3  2.16,10.03 180 top
D5  25.4,15.24 0 top
D6  22.86,21.59 180 top
FD1  6.48,51.82 0 top
FD2  6.48,51.82 0 bottom
FD3  39.37,1.27 0 top
FD4  39.37,1.27 0 bottom
FRAME1  -6.35,-33.02 0 top  (outside the outline)
H1  43.18,52.07 0 top
H2  43.18,2.54 0 top
H3  2.54,52.07 0 top
H4  2.54,2.54 0 top
I2C_PU  22.86,43.18 0 bottom
J1  12.7,6.6 0 top
J2  22.86,33.02 0 top
J3  33.02,6.6 0 top
J4  40.64,10.16 90 top
J5  38.1,44.45 270 top
J6  7.62,44.45 270 top
J8  22.86,5.08 180 top
J12  24.13,12.7 180 top
L1  27.94,29.21 90 top
LOGO1  22.86,51.56 0 top
LOGO2  43.31,16.38 0 top
LOGO3  42.8,5.71 0 top
PLED  2.16,8.13 0 bottom
Q2  20.32,17.78 90 top
R1  2.29,21.84 270 top
R3  19.05,29.21 270 top
R7  29.21,10.16 270 top
R8  36.83,10.16 270 top
R9  31.37,21.59 270 top
R11  7.37,10.16 270 top
R12  5.84,10.16 270 top
R13  8.89,10.16 270 top
R14  22.61,43.18 270 top
R15  24.13,43.18 270 top
R16  16.51,10.16 270 top
R17  33.02,21.59 90 top
R18  34.67,21.59 270 top
R20  25.4,17.53 180 top
S1  3.17,45.72 90 top
S2  42.55,45.72 90 top
S3  5.08,16.51 270 top
SHLD  37.34,3.43 0 bottom
SHLD1  8.38,3.3 180 bottom
U1  12.7,16.38 0 top
U2  22.86,29.21 270 top
U3  12.7,10.16 90 top
U5  33.02,10.16 270 top
U6  33.02,16.51 90 top
U$1  [#RXI#14]  5.21,41.4 0 top
U$2  [##RST##15]  4.95,39.37 0 top
U$3  [##CS##19]  40.13,39.37 0 top
U$4  [##CTS##25]  40.77,26.67 0 top
U$5  [##DTR##26]  40.77,24.13 0 top
U$6  [#D2#AD2#19]  33.91,41.91 0 bottom
U$7  [##RTS##24]  40.77,29.21 0 top
U$8  [FIRMWARE29]  12.7,7.62 0 top
U$9  [#3V3#1]  4.95,26.67 0 top
U$10  [#D0#18]  38.1,46.61 90 top
U$11  [#VBAT#5]  18.29,12.7 0 top
U$12  [#D3#AD3#22]  33.91,39.37 0 bottom
U$13  [#D4#PICO#24]  33.78,36.83 0 bottom
U$14  [#D12#POCI#23]  33.4,34.29 0 bottom
U$15  [#TXO#D13#13]  12.19,44.45 0 bottom
U$16  [#RXI#D14#15]  11.81,41.91 0 bottom
U$17  [##RST##15]  10.29,39.37 0 bottom
U$18  [#RSSI#D10#17]  12.06,36.83 0 bottom
U$19  [#AD1#D1#7]  11.43,31.75 0 bottom
U$20  [#GND#0]  26.8,12.7 0 top
U$21  [#EN#17]  9.78,34.29 0 bottom
U$22  [#SDA#D11#8]  11.94,29.21 0 bottom
U$23  [XBEE_335]  22.86,49.53 0 top
U$24  [#EN#17]  5.46,34.29 0 top
U$25  [#GND#0]  4.95,24.13 0 top
U$26  [#I2C#33]  22.86,44.83 0 bottom
U$27  [#ALED#21]  5.71,11.18 0 bottom
U$28  [#PICO#23]  41.02,36.83 0 top
U$29  [#POCI#22]  41.02,34.29 0 top
U$30  [#RST#30]  3.17,49.4 0 top
U$31  [#RSSI#16]  4.83,36.83 0 top
U$32  [#SCL#6]  5.21,31.75 0 top
U$33  [#SCLK#18]  41.15,41.4 0 top
U$34  [#SDA#7]  4.95,29.21 0 top
U$35  [#SHLD#30]  33.78,3.43 0 bottom
U$36  [#SHLD1#31]  12.19,3.3 0 bottom
U$37  [#VBAT#5]  18.29,12.7 0 bottom
U$38  [#GND#0]  26.8,12.7 0 bottom
U$39  [#D5#3]  40.13,31.75 0 top
U$40  [D03]  42.55,49.4 0 top
U$41  [#VIN#4]  5.21,21.59 0 top
U$42  [PWR26]  2.29,5.08 0 top
U$43  [ASSOC27]  2.92,8.13 0 top
U$44  [#3V3#1]  10.29,26.67 0 bottom
U$45  [#GND#0]  10.29,24.13 0 bottom
U$46  [#VIN#4]  10.03,21.59 0 bottom
U$47  [##SLP##27]  40.51,21.59 0 top
U$48  [#FIRMWARE#31]  12.19,19.05 0 top
U$49  [#I2C#31]  10.03,13.97 0 top
U$50  [#TXO#12]  7.62,47.24 270 top
U$51  [SMART_MODEM1337]  22.86,45.72 0 top
U$52  [CAT1336]  22.86,47.5 0 top
U$53  [XBEE_335]  22.86,39.37 0 bottom
U$54  [#PLED#20]  5.71,8.13 0 bottom
U$55  [#D0#AD0#18]  33.91,44.45 0 bottom
U$56  [#D5#ASSOC#24]  33.15,31.75 0 bottom
U$57  [#D6##RTS##24]  34.16,29.21 0 bottom
U$58  [#D7##CTS##25]  34.04,26.67 0 bottom
U$59  [#D8##DTR##26]  33.91,24.13 0 bottom
U$60  [#D9##SLP##27]  34.29,21.59 0 bottom
U$61  [CAT1336]  22.86,36.83 0 bottom
U$62  [SMART1337]  22.86,34.54 0 bottom
U$63  [SFE_LOGO_NAME_.2]  22.86,49.53 0 bottom
U$64  [MODEM1338]  22.86,33.02 0 bottom
U$65  [UART32]  33.02,7.49 0 top

### Tracks (layer width: path | path; a pad name or v marks a point on that pad's centre or on a via)
3.3V  (via drill 0.3, 0.35)
  Top 0.203: R11.1 v7.37,12.06
  Top 0.254: U1.10 13.99,17.38 v13.84,17.53 | R9.1 v31.37,23.5
  Top 0.508: J4.2 v41.79,9.66 | v2.29,23.75 R1.1 | U2.1 22.41,30.16 v22.61,30.35 | C5.1 38.99,13.92 v38.95,13.88
  Top 0.762: C7.1 C9.1 C10.1 | J2.1 18.19,44.13 C10.1 | v19.43,43.69 19.09,44.03 C10.1
  Route2 0.762: v22.61,30.35 22.61,31.75 24.26,33.4 v29.08,33.4
  Bottom 0.254: I2C_PU.2 v22.86,41.35
  other vias: 30.1,25.65 30.1,26.54 30.1,24.64 29.08,32.64 29.84,32.64 29.84,33.4
  pour Top (isolate 0.305, no thermals): 28.45,24 28.45,34.04 30.61,34.04 30.61,24.51 30.1,24
  pour Top (no thermals): 33.66,13.59 33.66,14.86 33.91,14.86 33.91,13.84 34.16,13.84 34.16,14.86 34.42,14.86 34.42,13.97 35.56,13.97 35.56,15.11 34.67,15.11 34.67,15.37 36.45,15.37 37.21,16.13 39.88,16.13 39.88,15.37 38.99,14.48 36.83,14.48 36.7,14.35 36.7,13.84 36.45,13.59
  pour Route15 (isolate 0.127, rank 3): 0,0 45.72,0 45.72,54.61 0,54.61
!RESET!  (via drill 0.3, 0.35)
  Top 0.254: S1.2 v1.27,46.99 S1.1 | J6.3 8.14,39.37 10.36,37.15 J2.5 | v5.84,39.37 4.83,39.37 4.36,38.9 C6.1
  Bottom 0.254: J6.3 v5.84,39.37 5.84,44.45 3.3,46.99 v1.27,46.99
D0  (via drill 0.35)
  Top 0.254: S2.1 v40.64,44.45 J5.1 35.98,44.45 35.66,44.13 J2.20 | S2.2 40.89,48.26 v41.91,48.26
  Route15 0.254: v40.64,44.45 40.64,47.24 41.66,48.26 v41.91,48.26
D1/SCL
  Top 0.254: J4.4 41.51,11.66 42.04,12.19 42.04,40.01 38.92,43.12 36.89,43.12 35.91,42.13 J2.19 31.24,42.13 29.34,44.03 R15.1 23.33,43.23 21.42,43.23 18.54,46.1 6.35,46.1 3.43,43.18 3.43,33.4 5.08,31.75 J6.6
D2/SPI_CLK
  Top 0.254: J2.18 36.32,40.13 J5.2
D3/SPI_!CS!
  Top 0.254: J2.17 36.86,38.13 J5.3
D4/SPI_PICO  (via drill 0.3)
  Top 0.254: v33.78,26.16 35.33,26.16 J2.11
  Bottom 0.254: J5.4 34.29,36.83 33.78,36.32 v33.78,26.16
D5/ASSOCIATE  (via drill 0.3)
  Top 0.203: 3.81,13.34 4.57,12.57 5.59,12.57 5.84,12.32 R12.1
  Top 0.254: J5.6 38.1,31.77 35.74,34.13 J2.15 34.85,34.13 34.35,34.63 34.35,36.41 33.55,37.21 28.32,37.21 26.67,35.56 v17.78,35.56 | v1.91,35.31 1.91,29.72 3.81,27.81 3.81,13.34
  Bottom 0.254: v17.78,35.56 2.16,35.56 v1.91,35.31
D6/!RTS!  (via drill 0.3)
  Top 0.254: J5.7 32.36,34.94 J2.16 | U6.19 30.12,17.76 29.84,18.03 29.84,19.43 30.35,19.94 v30.35,21.46 | v36.2,24.13 35.81,23.75 v35.81,21.46
  Bottom 0.254: v36.2,24.13 36.2,27.3 J5.7 | v30.35,21.46 v35.81,21.46
D7/!CTS!
  Top 0.254: J2.12 35.12,28.13 36.58,26.67 J5.8
D8/!DTR!  (via drill 0.3)
  Top 0.254: U6.23 29.48,15.76 v29.46,15.75 | v17.14,15.75 17.14,24.13 v14.1,27.18 | v10.41,27.18 10.36,27.23 J2.9
  Bottom 0.254: v17.14,15.75 v29.46,15.75 29.46,21.84 29.84,22.23 36.2,22.23 J5.9 | v14.1,27.18 v10.41,27.18
D9/!SLEEP!
  Top 0.254: J2.13 35.36,29.24 36.66,27.94 38.99,27.94 39.75,27.18 39.75,22.23 39.12,21.59 J5.10
D10/RSSI_PWM
  Top 0.254: J2.6 10.07,34.13 7.62,36.58 J6.4
D11/SDA  (via drill 0.3)
  Top 0.254: U1.2 v12.18,16.88 v12.19,16.89 | J4.3 41.99,10.66 42.55,11.21 42.55,45.47 41.15,46.86 23.24,46.86 22.61,46.23 R14.1 21.97,44.03 18.2,47.8 6.27,47.8 2.67,44.2 2.67,31.62 5.08,29.21 5.71,29.21 | J6.7 5.71,29.21 | v9.27,19.46 8.91,19.81 6.86,19.81 5.79,20.88 5.79,29.13 5.71,29.21
  Bottom 0.254: v12.19,16.89 12.09,16.99 12.09,17.64 11.44,18.29 10.41,18.29 9.27,19.43 v9.27,19.46
D12/SPI_POCI
  Top 0.254: J5.5 37.57,34.29 33.73,38.13 J2.4
D13/TXO  (via drill 0.3)
  Top 0.254: U6.20 29.19,17.26 28.93,17.53 v28.83,17.53 | v18.8,19.43 18.8,24.89 15.85,27.84 15.85,36.8 v15.88,36.83 | J6.1 9.94,42.13 J2.2 13.36,41.27 15.39,39.24 v15.88,39.24
  Bottom 0.254: v28.83,17.53 19.05,17.53 18.8,17.78 v18.8,19.43 | v15.88,36.83 v15.88,39.24
D14/RXI  (via drill 0.3)
  Top 0.254: U6.21 v28.58,16.76 v28.57,16.76 | v17.78,16.76 17.78,24.77 14.99,27.56 14.99,35.69 14.73,35.94 12.83,35.94 10.36,38.41 J2.3 9.4,40.13 J6.2
  Bottom 0.254: v28.57,16.76 v17.78,16.76
D+
  Top 0.203: J3.B6 33.77,5.58 33.53,5.33 33.02,5.33 32.77,5.58 J3.A6 32.77,10.42 33.46,11.11 U5.6 35.55,11.11 35.71,11.28 35.71,11.99 35.1,12.6 33.55,12.6 32.77,13.38 U6.3
D-  (via drill 0.3)
  Top 0.203: U6.4 33.27,13.39 33.71,12.95 35.26,12.95 36.07,12.14 36.07,9.88 35.4,9.21 U5.4 33.59,9.21 33.27,8.89 33.27,7.96 v33.3,7.92 33.27,7.89 J3.A7 | J3.B7 32.27,7.89 v32.23,7.92
  Bottom 0.203: v33.3,7.92 v32.23,7.92
DIRECT_D+
  Top 0.203: J1.B6 13.45,5.68 13.21,5.44 12.7,5.44 12.45,5.69 J1.A6 12.45,9.01 12.25,9.21 U3.6 10.27,9.21 9.65,9.83 9.65,12.06 11.99,14.4 11.99,15.82 11.43,16.38 U1.3
DIRECT_D-  (via drill 0.3)
  Top 0.203: U1.7 12.53,15.88 12.34,15.7 12.34,14.24 10.01,11.91 10.01,11.3 10.2,11.11 U3.4 12.51,11.11 12.95,10.67 12.95,8.16 v12.98,8.13 12.95,8.1 J1.A7 | J1.B7 11.95,7.99 v11.81,8.13
  Bottom 0.203: v11.81,8.13 v12.98,8.13
DIRECT_SELECT  (via drill 0.3)
  Top 0.254: v11.56,17.42 11.56,17.38 U1.1 | v7.87,17.4 7.87,16.76 7.62,16.51 S3.2 v6.86,16.51 | v2.29,15.49 2.29,16.48 S3.5
  Bottom 0.254: v11.56,17.42 11.54,17.4 v7.87,17.4 | v6.86,16.51 3.3,16.51 v2.29,15.49
EN  (via drill 0.3)
  Top 0.254: U2.2 20.7,29.21 19.85,30.06 R3.1 v19.05,31.11
  Bottom 0.254: v19.05,31.11 19.05,32.26 18.03,33.27 8.64,33.27 J6.5
GND  (via drill 0.3, 0.35)
  Top 0.254: U6.2 32.27,15.76 U6.PAD | U1.9 13.71,16.88 v13.46,16.64
  Top 0.762: J8.1 23.86,12.43 J12.1 | R8.1 v36.83,12.06
  Bottom 0.203: PLED.1 v4.7,8.13
  Bottom 0.254: ALED.1 v4.7,11.18
  Bottom 0.508: v38.61,3.43 SHLD.1
  Bottom 0.559: SHLD1.1 v7.11,3.3
  other vias: 19.43,24.13 15.24,41.15 30.48,53.34 8.89,12.06 25.91,25.91 25.91,24.51 28.7,18.41 28.96,15.11 34.04,8.13 29.21,12.19 41.91,8.64 39.37,8.64 16.51,12.19 6.6,13.97 6.73,17.4 3.05,17.65 19.43,19.94 17.65,27.18 34.67,23.5 16.76,41.15 18.41,41.15 16.51,38.86 16.76,36.32 32,13.34 32.13,23.5 23.88,5.71 37.47,18.41 38.99,18.41 26.29,18.54 36.58,21.46 30.48,45.72 36.7,43.81 44.45,45.72 44.45,39.37 44.45,33.02 44.45,26.67 44.45,20.32 44.45,14.1 2.54,45.72 15.24,53.34 22.86,53.34 22.86,3.81 27.94,3.81 17.78,3.81 1.27,39.37 1.27,33.02 1.27,26.67 1.27,20.32 1.27,15.37 41.78,42.42 36.58,41.27 13.46,25.02 33.02,16.51
  pour Top (isolate 0.127, rank 3): 0,0 45.72,0 45.72,54.61 0,54.61
  pour Route2 (isolate 0.127, rank 3): 0,0 45.72,0 45.72,54.61 0,54.61
  pour Bottom (isolate 0.127, rank 3): 0,0 45.72,0 45.72,54.61 0,54.61
N$1
  Top 0.254: C3.1 24.55,31.36 24.23,31.05 U2.6
N$3  (via drill 0.3)
  Top 0.254: S3.4 2.29,19.04 | R1.2 2.29,19.3 2.42,19.17 2.29,19.04 | S3.1 6.9,19.01 v6.86,19.05 | v2.29,17.91 2.29,19.04
  Bottom 0.254: v6.86,19.05 2.79,19.05 2.29,18.54 v2.29,17.91
N$4
  Top 0.254: J3.B5 34.77,6.83 35.56,7.62 36.2,7.62 36.83,8.26 R8.2
N$5
  Top 0.254: J3.A5 31.77,7.6 30.06,9.31 R7.2
N$7
  Top 0.203: D2.A 6.6,6.48 7.37,7.24 R11.2
N$8
  pour Top (isolate 0.305, no thermals): 23.62,28.83 25.65,28.83 25.65,26.92 26.92,26.92 27.3,27.3 27.3,33.02 25.65,33.02 25.65,29.59 23.62,29.59
N$9
  Top 0.254: U6.9 35.69,16.26 36.2,16.76 36.2,18.92 35.69,19.43 31.75,19.43 31.37,19.81 R9.2
N$10
  Top 0.254: U6.8 36.21,15.76 36.7,16.26 36.7,19.94 35.9,20.74 R18.2 R17.1
N$11  (via drill 0.3)
  Top 0.254: R14.2 21.88,42.33 v21.59,42.04
  Bottom 0.254: v21.59,42.04 21.82,42.27 I2C_PU.3
N$12
  Top 0.203: R12.2 5.84,9.53 5.33,10.03 D3.A
N$13  (via drill 0.3)
  Top 0.254: R15.2 24.17,42.29 v25.4,42.29
  Bottom 0.254: v25.4,42.29 25.4,42.67 24.89,43.18 I2C_PU.1
N$14
  Top 0.254: J1.B5 14.45,8.23 15.53,9.31 R16.2
N$15
  pour Top (no thermals): 18.54,28.83 19.68,28.83 20.07,28.45 22.1,28.45 22.1,18.67 21.72,18.29 20.95,18.29 20.07,19.18 20.07,26.29 18.54,27.81
N$16
  Top 0.254: J1.A5 11.45,7.6 11.05,8 9.27,8 8.89,8.38 R13.2
N$21  (via drill 0.3)
  Top 0.254: v1.08,12.26 1.08,10.24 D3.C
  Bottom 0.254: ALED.2 1.64,11.56 1.08,12.12 v1.08,12.26
N$23  (via drill 0.3)
  Top 0.203: D2.C 1.28,8.75 v1.02,9.02
  Bottom 0.203: v1.02,9.02 1.02,9 1.64,8.38 PLED.2
SHLD
  pour Top (isolate 0.178, rank 2): 28.7,5.97 28.7,0.89 37.34,0.89 37.34,6.1
  pour Bottom (isolate 0.178): 28.7,5.97 28.7,0.89 37.34,0.89 37.34,5.97
SHLD1
  pour Bottom (isolate 0.178): 8.38,5.97 8.38,0.89 17.02,0.89 17.02,5.97
  pour Top (isolate 0.178, rank 2): 8.38,5.84 8.38,0.89 17.02,0.89 17.02,5.97
V_BATT
  Top 0.559: J8.2 21.86,12.43 J12.2 20.19,14.1 20.19,16.93 19.35,17.78 Q2.3
V_USB  (via drill 0.3)
  Top 0.254: U5.5 v35.53,10.16
  Top 0.559: J3.VBUS1 30.57,7.53
  Top 0.762: 30.57,7.53 30.12,7.98 27.27,7.98 26.55,8.69 v26.55,10.16 D5.A
  Bottom 0.254: v35.53,10.16 v26.55,10.16
  pour Top (no thermals): 30.48,6.73 30.48,5.59 32.13,3.94 34.04,3.94 35.56,5.46 35.56,6.6 35.43,6.73
V_USB_2  (via drill 0.3)
  Top 0.254: U3.5 v10.19,10.16
  Top 0.559: J1.VBUS2 15.15,7.53
  Top 0.762: 15.15,7.53 15.62,8 18.29,8 19.17,8.88 v19.17,10.16 D1.A
  Bottom 0.254: v10.19,10.16 v19.17,10.16
  pour Top (no thermals): 10.16,6.73 10.16,5.59 11.81,3.94 13.72,3.94 15.24,5.46 15.24,6.6 15.11,6.73
VIN  (via drill 0.3, 0.35)
  Top 0.254: R17.2 v33.02,23.5
  Bottom 0.254: v33.02,23.5 32.38,22.86 29.21,22.86 27.81,21.46 25.65,21.46
  Bottom 0.762: J6.10 24.13,21.59
  other vias: 24.51,19.43 24.51,20.32 25.27,20.32 25.27,19.56
  pour Top (isolate 0.305, no thermals): 21.21,14.73 24.64,14.73 25.15,15.24 25.15,18.8 26.16,19.81 26.16,22.48 23.88,22.48 23.88,18.41 22.73,17.27 20.83,17.27 20.83,15.11
  pour Bottom (no thermals): 23.88,22.48 23.88,18.54 24.89,18.54 26.16,19.81 26.16,22.48
XBEE_D+/SDA
  Top 0.203: U1.4 9.64,15.88 9.4,16.13 9.4,18.03 10.54,19.18 11.3,19.18 11.68,19.56 11.68,31.32 11.05,31.95 11.05,32.13 J2.7
XBEE_D-
  Top 0.203: U1.6 15.89,15.38 16.13,15.62 16.13,18.03 14.99,19.18 12.45,19.18 12.1,19.52 12.1,29.38 12.85,30.13 J2.8

### Text on the board
Top: 1
Route2: 2
Route15: 3
Bottom: 4 | v01
Milling: Route Out
Measures: Units in Inches
tDocu: Elias Santistevan